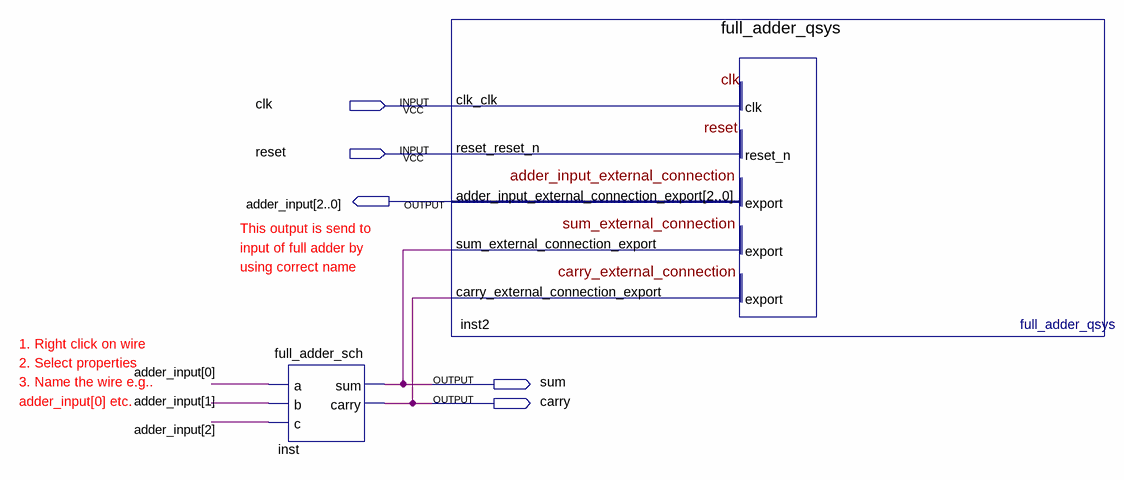
[diagram p0: schematic sheet]
// Quartus schematic full_adder_nios_test.bdf as structural Verilog: 2 symbols, 5 pins
module full_adder_nios_test (
  input  clk,
  input  reset,
  output [2:0] adder_input,
  output sum,
  output carry
);

  full_adder_sch inst (.a(adder_input[0]), .b(adder_input[1]), .c(adder_input[2]), .sum(sum), .carry(carry));
  full_adder_qsys inst2 (
    .clk_clk(clk), .reset_reset_n(reset), .sum_external_connection_export(sum),
    .carry_external_connection_export(carry), .adder_input_external_connection_export(adder_input));

  // Notes on the sheet:
  //   This output is send to 
  //   input of full adder by
  //   using correct name
  //   1. Right click on wire
  //   2. Select properties
  //   3. Name the wire e.g.. 
  //   adder_input[0] etc.
endmodule
